# EAGLE design uSD_test_board (EAGLE 7.6.0)
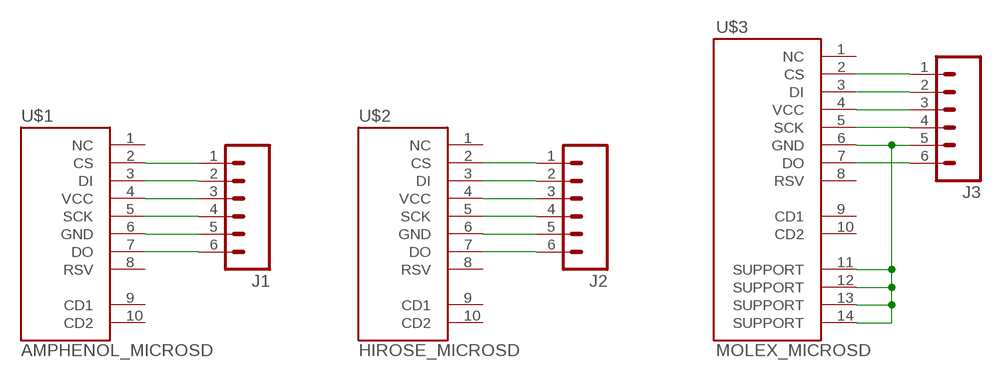
[diagram p0: schematic, sheet 1]

## Parts
J1  M06SILK_FEMALE_PTH  [1X06]
J2  M06SILK_FEMALE_PTH  [1X06]
J3  M06SILK_FEMALE_PTH  [1X06]
U$1  AMPHENOL_MICROSD  [AMPHENOL_MICROSD]
U$2  HIROSE_MICROSD  [AMPHENOL_MICROSD]
U$3  MOLEX_MICROSD  [MOLEX_MICROSD]

## Nets
CS1: J1.1 U$1.2(CS)
CS2: J2.1 U$2.2(CS)
CS3: J3.1 U$3.2(CS)
DI1: J1.2 U$1.3(DI)
DI2: J2.2 U$2.3(DI)
DI3: J3.2 U$3.3(DI)
DO1: J1.6 U$1.7(DO)
DO2: J2.6 U$2.7(DO)
DO3: J3.6 U$3.7(DO)
GND: J1.5 J2.5 J3.5 U$1.6(GND) U$2.6(GND) U$3.6(GND) U$3.11(SUPPORT) U$3.12(SUPPORT) U$3.13(SUPPORT) U$3.14(SUPPORT)
SCK1: J1.4 U$1.5(SCK)
SCK2: J2.4 U$2.5(SCK)
SCK3: J3.4 U$3.5(SCK)
VCC1: J1.3 U$1.4(VCC)
VCC2: J2.3 U$2.4(VCC)
VCC3: J3.3 U$3.4(VCC)
Unconnected: U$1.1(NC) U$1.8(RSV) U$1.9(CD1) U$1.10(CD2) U$2.1(NC) U$2.8(RSV) U$2.9(CD1) U$2.10(CD2) U$3.1(NC) U$3.8(RSV) U$3.9(CD1) U$3.10(CD2)

## Library data of the parts
J1-J3 = SparkFun-Connectors:M06: Header 6 Standard 6-pin 0.1" header. Use with straight break away headers (SKU : PRT-00116), right angle break away headers (PRT-00553), swiss pins (PRT-00743), machine pins (PRT-00117), and female headers (PRT-00115). Molex polarized connector foot print use with SKU : PRT-08094 with associated crimp pins and housings. NOTES ON THE VARIANTS LOCK and LOCK_LONGPADS... This footprint was designed to help hold the alignment of a through-hole component (i.e. 6-pin header) while soldering it into place. You may notice that each hole has been shifted either up or down by 0.005 of an inch from it's more standard position (which is a perfectly straight line). This slight alteration caused the pins (the squares in the middle) to touch the edges of the holes. Because they are alternating, it causes a "brace" to hold the component in place. 0.005 has proven to be the perfect amount of "off-center" position when using our standard breakaway headers. Although looks a little odd when you look at the bare footprint, once you have a header in there, the alteration is very hard to notice. Also,if you push a header all the way into place, it is covered up entirely on the bottom side. This idea of altering the position of holes to aid alignment will be further integrated into the Sparkfun Library for other footprints. It can help hold any component with 3 or more connection pins.; PROD_ID: CONN-08437
U$1 = sharkdunio:AMPHENOL_MICROSD: Amphenol 114-00841-68 microSD slot
U$2 = sharkdunio:HIROSE_MICROSD: Hirose DM3D-SF uSD slot
U$3 = sharkdunio:MOLEX_MICROSD: molex 1040310811 uSD slot

## Board
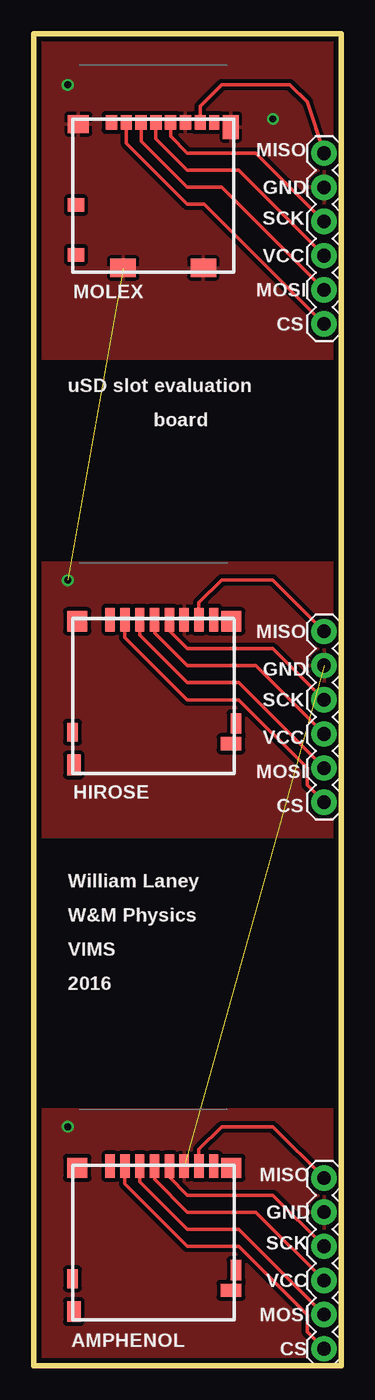
[diagram p1: board, top side]
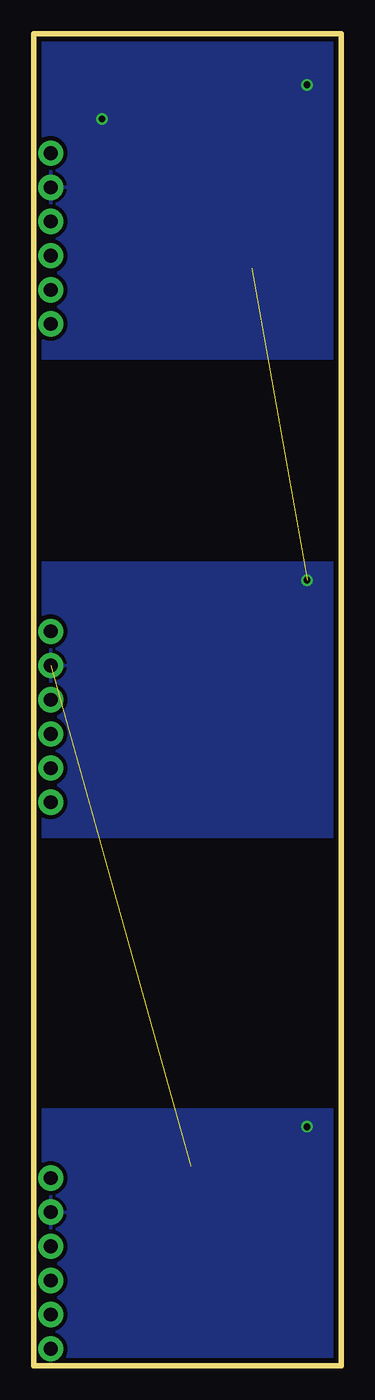
[diagram p2: board, bottom side, seen from below]

Size 22.86 x 99.06 mm. Coordinates in mm from the lower left corner, seen from the top.
Outline: 0,0 22.86,0 22.86,99.06 0,99.06 0,0
Copper layers (1*16): Top 0.0356mm / dielectric 1.5011mm / Bottom 0.0356mm
Design rules "oshpark-2layer": minimum track width 6mil, minimum drill 13mil, track to track 6mil, track to pad 6mil, pad to pad 6mil, via to via 6mil, smd to smd 6mil, copper to edge 15mil, drill to drill 6mil, minimum pad ring 7mil, minimum via ring 7mil, stop-mask expansion 2.5mil, vias tented up to drill 0mil, thermal gap 10mil

### Footprints (pad centres in the part's own frame; a part is rotated, then mirrored left to right if it is on the bottom)
1X06 = drill 1.016 pad 1.88: 1 0,0; 2 2.54,0; 3 5.08,0; 4 7.62,0; 5 10.16,0; 6 12.7,0
AMPHENOL_MICROSD = smd 0.7 x 1.75: 1 3.2,-0.875; 2 2.1,-0.875; 3 1,-0.875; 4 -0.1,-0.875; 5 -1.2,-0.875; 6 -2.3,-0.875; 7 -3.4,-0.875; 8 -4.5,-0.875 | smd 1.55 x 1: 9 -5.775,8.35 | smd 1 x 1.55: 10 5.9,9.925 | smd 1.5 x 1.5: P$9 -5.8,-0.75; P$10 5.65,-0.75 | smd 0.8 x 1.5: P$11 -6.15,6.85 | smd 0.8 x 1.4: P$12 6,7.5
MOLEX_MICROSD = smd 0.85 x 1.1: 1 3.105,0.25; 2 2.005,0.25; 3 0.905,0.25; 4 -0.195,0.25; 5 -1.295,0.25; 6 -2.395,0.25; 7 -3.495,0.25 | smd 0.75 x 1.1: 8 -4.545,0.25 | smd 1.2 x 1: 9 5.74,6.4; 10 5.74,10.1 | smd 1.9 x 1.35: 11 2.24,11.075; 12 -3.73,11.075 | smd 1.17 x 1.8: 13 -5.755,0.6 | smd 1.55 x 1.35: 14 5.565,0.375

### Placement (x,y rotation side)
J1  21.59,1.27 90 top
J2  21.59,41.91 90 top
J3  21.59,77.47 90 top
U$1  8.89,13.97 180 top
U$2  8.89,54.61 180 top
U$3  8.89,92.71 180 top

### Tracks (layer width: path | path; a pad name or v marks a point on that pad's centre or on a via)
CS1
  Top 0.254: U$1.2 6.79,13.53 11.43,8.89 15.24,8.89 20.32,3.81 20.32,2.54 J1.1
CS2
  Top 0.254: U$2.2 6.79,54.17 11.43,49.53 15.24,49.53 20.32,44.45 20.32,43.18 J2.1
CS3
  Top 0.254: U$3.2 6.88,90.91 11.43,86.36 12.7,86.36 J3.1
DI1
  Top 0.254: U$1.3 7.89,13.7 11.43,10.16 15.24,10.16 J1.2
DI2
  Top 0.254: U$2.3 7.89,54.34 11.43,50.8 15.24,50.8 J2.2
DI3
  Top 0.254: U$3.3 7.99,91.08 11.43,87.63 13.97,87.63 J3.2
DO1
  Top 0.254: U$1.7 12.29,16.1 13.97,17.78 17.78,17.78 J1.6
DO2
  Top 0.254: J2.6 17.78,58.42 13.97,58.42 12.29,56.74 U$2.7
DO3
  Top 0.254: J3.6 20.32,93.98 19.05,95.25 13.97,95.25 12.38,93.67 U$3.7
GND  (via drill 0.51)  (2 unrouted)
  other vias: 17.78,92.71 2.54,17.78 2.54,58.42 2.54,95.25
  pour Bottom (isolate 0.305): 0,99.06 0,74.93 22.86,74.93 22.86,99.06
  pour Top (isolate 0.305): 0,99.06 0,74.93 22.86,74.93 22.86,99.06
  pour Top (isolate 0.305): 0,59.69 22.86,59.69 22.86,39.37 0,39.37
  pour Bottom (isolate 0.305): 0,59.69 0,39.37 22.86,39.37 22.86,59.69
  pour Bottom (isolate 0.305): 0,19.05 22.86,19.05 22.86,0 0,0
  pour Top (isolate 0.305): 0,19.05 22.86,19.05 22.86,0 0,0
SCK1
  Top 0.254: U$1.5 10.09,14.04 11.43,12.7 17.78,12.7 J1.4
SCK2
  Top 0.254: U$2.5 10.09,54.68 11.43,53.34 17.78,53.34 J2.4
SCK3
  Top 0.254: U$3.5 10.19,91.42 11.43,90.17 16.51,90.17 J3.4
VCC1
  Top 0.254: U$1.4 8.99,13.87 11.43,11.43 16.51,11.43 J1.3
VCC2
  Top 0.254: U$2.4 8.99,54.51 11.43,52.07 16.51,52.07 J2.3
VCC3
  Top 0.254: U$3.4 9.09,91.25 11.43,88.9 15.24,88.9 J3.3

### Text on the board
tPlace: MISO | GND | SCK | VCC | MOSI | MOLEX | CS | uSD slot evaluation | board | MISO | GND | SCK | VCC | MOSI | HIROSE | CS | William Laney | W&M Physics | VIMS | 2016 | MISO | GND | SCK | VCC | MOSI | AMPHENOL | CS